# Altium schematic sheet Sheet1.SchDoc
size A4
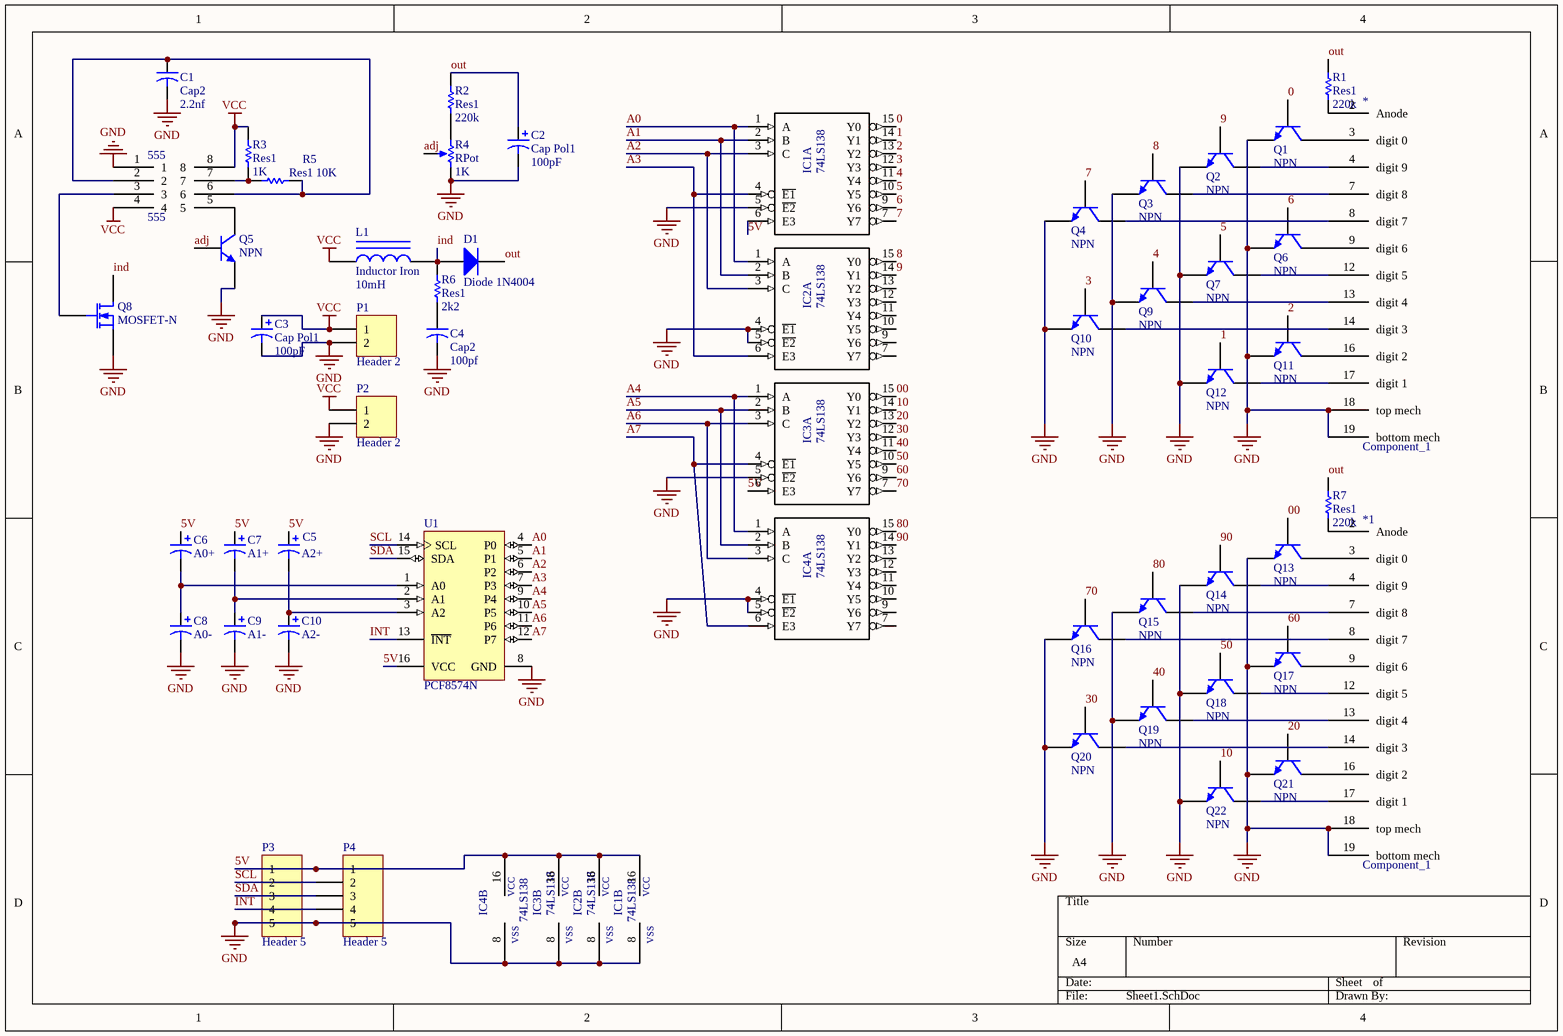
[diagram p0: Sheet1.SchDoc]

## Parts
555  555  [555]
*  Component_1  [B8091]
*1  Component_1  [B8091]
C1  Cap2  value 2.2nf  [CAPR5-4X5]
C2  Cap Pol1  value 100pF  [RB7.6-15]
C3  Cap Pol1  value 100pF  [RB7.6-15]
C4  Cap2  value 100pf  [CAPR5-4X5]
C5  A2+  [C0805]
C6  A0+  [C0805]
C7  A1+  [C0805]
C8  A0-  [C0805]
C9  A1-  [C0805]
C10  A2-  [C0805]
D1  Diode 1N4004  [DO-41]
IC1  74LS138  [DIP-16]  (parts A,B of 2)
IC2  74LS138  [DIP-16]  (parts A,B of 2)
IC3  74LS138  [DIP-16]  (parts A,B of 2)
IC4  74LS138  [DIP-16]  (parts A,B of 2)
L1  Inductor Iron  value 10mH  [AXIAL-0.5]
P1  Header 2  [HDR1X2]
P2  Header 2  [HDR1X2]
P3  Header 5  [HDR1X5]
P4  Header 5  [HDR1X5]
Q1  NPN  [TO-226-AA]
Q2  NPN  [TO-226-AA]
Q3  NPN  [TO-226-AA]
Q4  NPN  [TO-226-AA]
Q5  NPN  [TO-226-AA]
Q6  NPN  [TO-226-AA]
Q7  NPN  [TO-226-AA]
Q8  MOSFET-N  [E3]
Q9  NPN  [TO-226-AA]
Q10  NPN  [TO-226-AA]
Q11  NPN  [TO-226-AA]
Q12  NPN  [TO-226-AA]
Q13  NPN  [TO-226-AA]
Q14  NPN  [TO-226-AA]
Q15  NPN  [TO-226-AA]
Q16  NPN  [TO-226-AA]
Q17  NPN  [TO-226-AA]
Q18  NPN  [TO-226-AA]
Q19  NPN  [TO-226-AA]
Q20  NPN  [TO-226-AA]
Q21  NPN  [TO-226-AA]
Q22  NPN  [TO-226-AA]
R1  Res1  value 220k  [AXIAL-0.3]
R2  Res1  value 220k  [AXIAL-0.3]
R3  Res1  value 1K  [AXIAL-0.3]
R4  RPot  value 1K  [VR5]
R5  Res1  value 10K  [AXIAL-0.3]
R6  Res1  value 2k2  [AXIAL-0.3]
R7  Res1  value 220k  [AXIAL-0.3]
U1  PCF8574N  [N0016A]

## Nets
GND: 555.1 *.18(top_mech) *.19(bottom_mech) *1.18(top_mech) *1.19(bottom_mech) C1.2 C2.2 C3.2 C4.2 C8.2 C9.2 C10.2 IC1.5(~{E2}) IC1.8(VSS) IC2.4(~{E1}) IC2.5(~{E2}) IC2.8(VSS) IC3.5(~{E2}) IC3.8(VSS) IC4.4(~{E1}) IC4.5(~{E2}) IC4.8(VSS) P1.2 P2.2 P3.5 P4.5 Q1.3(E) Q2.3(E) Q3.3(E) Q4.3(E) Q5.3(E) Q6.3(E) Q7.3(E) Q8.3(S) Q9.3(E) Q10.3(E) Q11.3(E) Q12.3(E) Q13.3(E) Q14.3(E) Q15.3(E) Q16.3(E) Q17.3(E) Q18.3(E) Q19.3(E) Q20.3(E) Q21.3(E) Q22.3(E) R4.2(BOT) U1.8(GND)
VCC: 555.4 555.8 C3.1 L1.1 P1.1 P2.1 R3.2
0: IC1.15(Y0) Q1.2(B)
00: IC3.15(Y0) Q13.2(B)
1: IC1.14(Y1) Q12.2(B)
2: IC1.13(Y2) Q11.2(B)
3: IC1.12(Y3) Q10.2(B)
4: IC1.11(Y4) Q9.2(B)
5: IC1.10(Y5) Q7.2(B)
5V: C5.1 C6.1 C7.1 IC1.6(E3) IC1.16(VCC) IC2.16(VCC) IC3.6(E3) IC3.16(VCC) IC4.16(VCC) P3.1 P4.1 U1.16(VCC)
6: IC1.9(Y6) Q6.2(B)
7: IC1.7(Y7) Q4.2(B)
8: IC2.15(Y0) Q3.2(B)
9: IC2.14(Y1) Q2.2(B)
10: IC3.14(Y1) Q22.2(B)
20: IC3.13(Y2) Q21.2(B)
30: IC3.12(Y3) Q20.2(B)
40: IC3.11(Y4) Q19.2(B)
50: IC3.10(Y5) Q18.2(B)
60: IC3.9(Y6) Q17.2(B)
70: IC3.7(Y7) Q16.2(B)
80: IC4.15(Y0) Q15.2(B)
90: IC4.14(Y1) Q14.2(B)
A0: IC1.1(A) IC2.1(A) U1.4(P0)
A1: IC1.2(B) IC2.2(B) U1.5(P1)
A2: IC1.3(C) IC2.3(C) U1.6(P2)
A3: IC1.4(~{E1}) IC2.6(E3) U1.7(P3)
A4: IC3.1(A) IC4.1(A) U1.9(P4)
A5: IC3.2(B) IC4.2(B) U1.10(P5)
A6: IC3.3(C) IC4.3(C) U1.11(P6)
A7: IC3.4(~{E1}) IC4.6(E3) U1.12(P7)
adj: Q5.2(B) R4.3(TAP)
ind: D1.1(A) L1.2 Q8.1(D) R6.2
INT: P3.4 P4.4 U1.13(~{INT})
out: C2.1 D1.2(K) R1.2 R2.2 R7.2
SCL: P3.2 P4.2 U1.14(SCL)
SDA: P3.3 P4.3 U1.15(SDA)
Net555_2: 555.2 555.6 C1.1 R5.1
Net555_3: 555.3 Q8.2(G)
Net555_5: 555.5 Q5.1(C)
Net555_7: 555.7 R3.1 R5.2
Net*1_2: *1.2(Anode) R7.1
Net*1_3: *1.3(digit_0) Q13.1(C)
Net*1_4: *1.4(digit_9) Q14.1(C)
Net*1_7: *1.7(digit_8) Q15.1(C)
Net*1_8: *1.8(digit_7) Q16.1(C)
Net*1_9: *1.9(digit_6) Q17.1(C)
Net*1_12: *1.12(digit_5) Q18.1(C)
Net*1_13: *1.13(digit_4) Q19.1(C)
Net*1_14: *1.14(digit_3) Q20.1(C)
Net*1_16: *1.16(digit_2) Q21.1(C)
Net*1_17: *1.17(digit_1) Q22.1(C)
Net*_2: *.2(Anode) R1.1
Net*_3: *.3(digit_0) Q1.1(C)
Net*_4: *.4(digit_9) Q2.1(C)
Net*_7: *.7(digit_8) Q3.1(C)
Net*_8: *.8(digit_7) Q4.1(C)
Net*_9: *.9(digit_6) Q6.1(C)
Net*_12: *.12(digit_5) Q7.1(C)
Net*_13: *.13(digit_4) Q9.1(C)
Net*_14: *.14(digit_3) Q10.1(C)
Net*_16: *.16(digit_2) Q11.1(C)
Net*_17: *.17(digit_1) Q12.1(C)
NetC4_1: C4.1 R6.1
NetC5_2: C5.2 C10.1 U1.3(A2)
NetC6_2: C6.2 C8.1 U1.1(A0)
NetC7_2: C7.2 C9.1 U1.2(A1)
NetR2_1: R2.1 R4.1(TOP)

Not connected (* = marked no-connect by the designer): IC2 7(Y7) 9(Y6) 10(Y5) 11(Y4) 12(Y3) 13(Y2); IC4 7(Y7) 9(Y6) 10(Y5) 11(Y4) 12(Y3) 13(Y2)

## Library data of the parts
C1 C4 = Cap2: Capacitor; Published: 23-Sep-2002; PackageReference: CAPR5-4X5; Publisher: Altium Limited; PackageDescription: Capacitor; 2 Leads
C2 C3 = Cap Pol1: Polarized Capacitor (Radial); Published: 8-Jun-2000; LatestRevisionDate: 17-Jul-2002; LatestRevisionNote: Re-released for DXP Platform.; PackageReference: RB7.6-15; Publisher: Altium Limited; PackageDescription: Polarized Capacitor (Radial); 2 Leads
C5-C10 = Cap Pol3: Polarized Capacitor (Surface Mount); Published: 8-Jun-2000; LatestRevisionDate: 29-May-2009; LatestRevisionNote: IPC-7351 Footprint Added.; PackageReference: C0805; Publisher: Altium Limited; PackageDescription: Chip Capacitor
D1 = Diode 1N4004: 1 Amp General Purpose Rectifier; Published: 8-Jun-2000; LatestRevisionDate: 17-Jul-2002; LatestRevisionNote: Re-released for DXP Platform.; DatasheetVersion: 1998; PackageVersion: Aug-1999; PackageReference: DO-41; Publisher: Altium Limited; PackageDescription: Diode, Axial; Body 5.2 x 2.7 mm (LxDia. max), Lead Dia. 0.86 mm (max); Code_JEDEC: DO-204-AL; ComponentLink1Description: Manufacturer Link; ComponentLink1URL: http://www.fairchildsemi.com/; ComponentLink2Description: Datasheet; ComponentLink2URL: http://www.fairchildsemi.com/ds/1N%2F1N4001.pdf
IC1-IC4 = 74LS138: MF: Texas Instruments; Price: None; Package: None; Availability: Unavailable; MP: 74LS138; SnapEDA_Link: https://www.snapeda.com/parts/74LS138/Texas%20Instruments/view-part/?ref=snap; Value: *
L1 = Inductor Iron: Magnetic-Core Inductor; Published: 24-Mar-1999; LatestRevisionDate: 17-Jul-2002; LatestRevisionNote: Re-released for DXP Platform.; PackageReference: AXIAL-0.9; Publisher: Altium Limited; PackageDescription: Axial Device, Thru-Hole; 2 Leads; 0.9 in Pin Spacing
P1 P2 = Header 2: Header, 2-Pin; LatestRevisionDate: 17-Jul-2002; LatestRevisionNote: Re-released for DXP Platform.; Publisher: Altium Limited
P3 P4 = Header 5: Header, 5-Pin; LatestRevisionDate: 17-Jul-2002; LatestRevisionNote: Re-released for DXP Platform.; Publisher: Altium Limited
Q1-Q7 Q9-Q22 = NPN: NPN Bipolar Transistor; Published: 8-Jun-2000; LatestRevisionDate: 17-Jul-2002; LatestRevisionNote: Re-released for DXP Platform.; PackageReference: TO-226-AA; Publisher: Altium Limited; PackageDescription: TO, Flat Index; 3 In-Line, Axial Leads; Body Dia. 4.8mm; Leads 0.55 x 0.51 mm (max); Code_JEDEC: TO-226-AA
Q8 = MOSFET-N: N-Channel MOSFET; Published: 8-Jun-2000; LatestRevisionDate: 17-Jul-2002; LatestRevisionNote: Re-released for DXP Platform.; PackageVersion: 1995/1996; PackageReference: E3; Publisher: Altium Limited; PackageDescription: TO, Flat Index; 3 In-Line, Axial Leads; Body Dia. 4.6mm; Lead Dia. 0.5 mm (max)
R1-R3 R5-R7 = Res1: Resistor; Published: 8-Jun-2000; LatestRevisionDate: 17-Jul-2002; LatestRevisionNote: Re-released for DXP Platform.; PackageReference: AXIAL-0.3; Publisher: Altium Limited; PackageDescription: Axial Device, Thru-Hole; 2 Leads; 0.3 in Pin Spacing
R4 = RPot: Potentiometer; Sim Note: Enter the Resistance value and the set point into parameter fields.; Set Position: 0.5; Published: 8-Jun-2000; LatestRevisionDate: 17-Jul-2002; LatestRevisionNote: Re-released for DXP Platform.; PackageReference: VR5; Publisher: Altium Limited; PackageDescription: Variable Resistor, Thru-Hole; 3 Leads
U1 = CMP-0314-00016-2: Remote 8-Bit I/O Expander for I2C-Bus, 2.5 to 6 V, -40 to 85 degC, 16-pin PDIP (N), Pb-Free (RoHS); Manufacturer: Texas Instruments; fSCLK(Max)(MHz): 0.1; # of I/Os: 8; VCC(Min)(V): 2.5; I2C Address: 0100 xxx; Voltage Nodes(V): 5, 3.3; Eco-Plan: Green (RoHS & no Sb/Br); Max Frequency(kHz): 100; SubFamily: I2C IO Expander; VCC(Max)(V): 6; Interrupt Output: Yes; Vcc range(V): 2.5 to 6.0; Reset Input: No; ComponentLink1Description: Datasheet; ComponentLink1URL: http://www.ti.com/general/docs/lit/getliterature.tsp?genericPartNumber=PCF8574&fileType=pdf; PackageDescription: 16-Pin Plastic Dual-In-Line Package, Row Spacing 7.62 mm, Pitch 2.54 mm; PackageVersion: revE, Dec-2002; ComponentLink2URL: http://www.ti.com/litv/pdf/mpdi002c; ComponentLink2Description: Package Specification; DatasheetVersion: SCPS068G; PackageReference: N0016A; PartNumber: PCF8574N; Push-Pull I/O Type: Yes; Code_JEDEC: MS-001*; Mounting Technology: Through-hole